# EAGLE design altair (EAGLE 9.4.1)

## Sheet 1 of 2
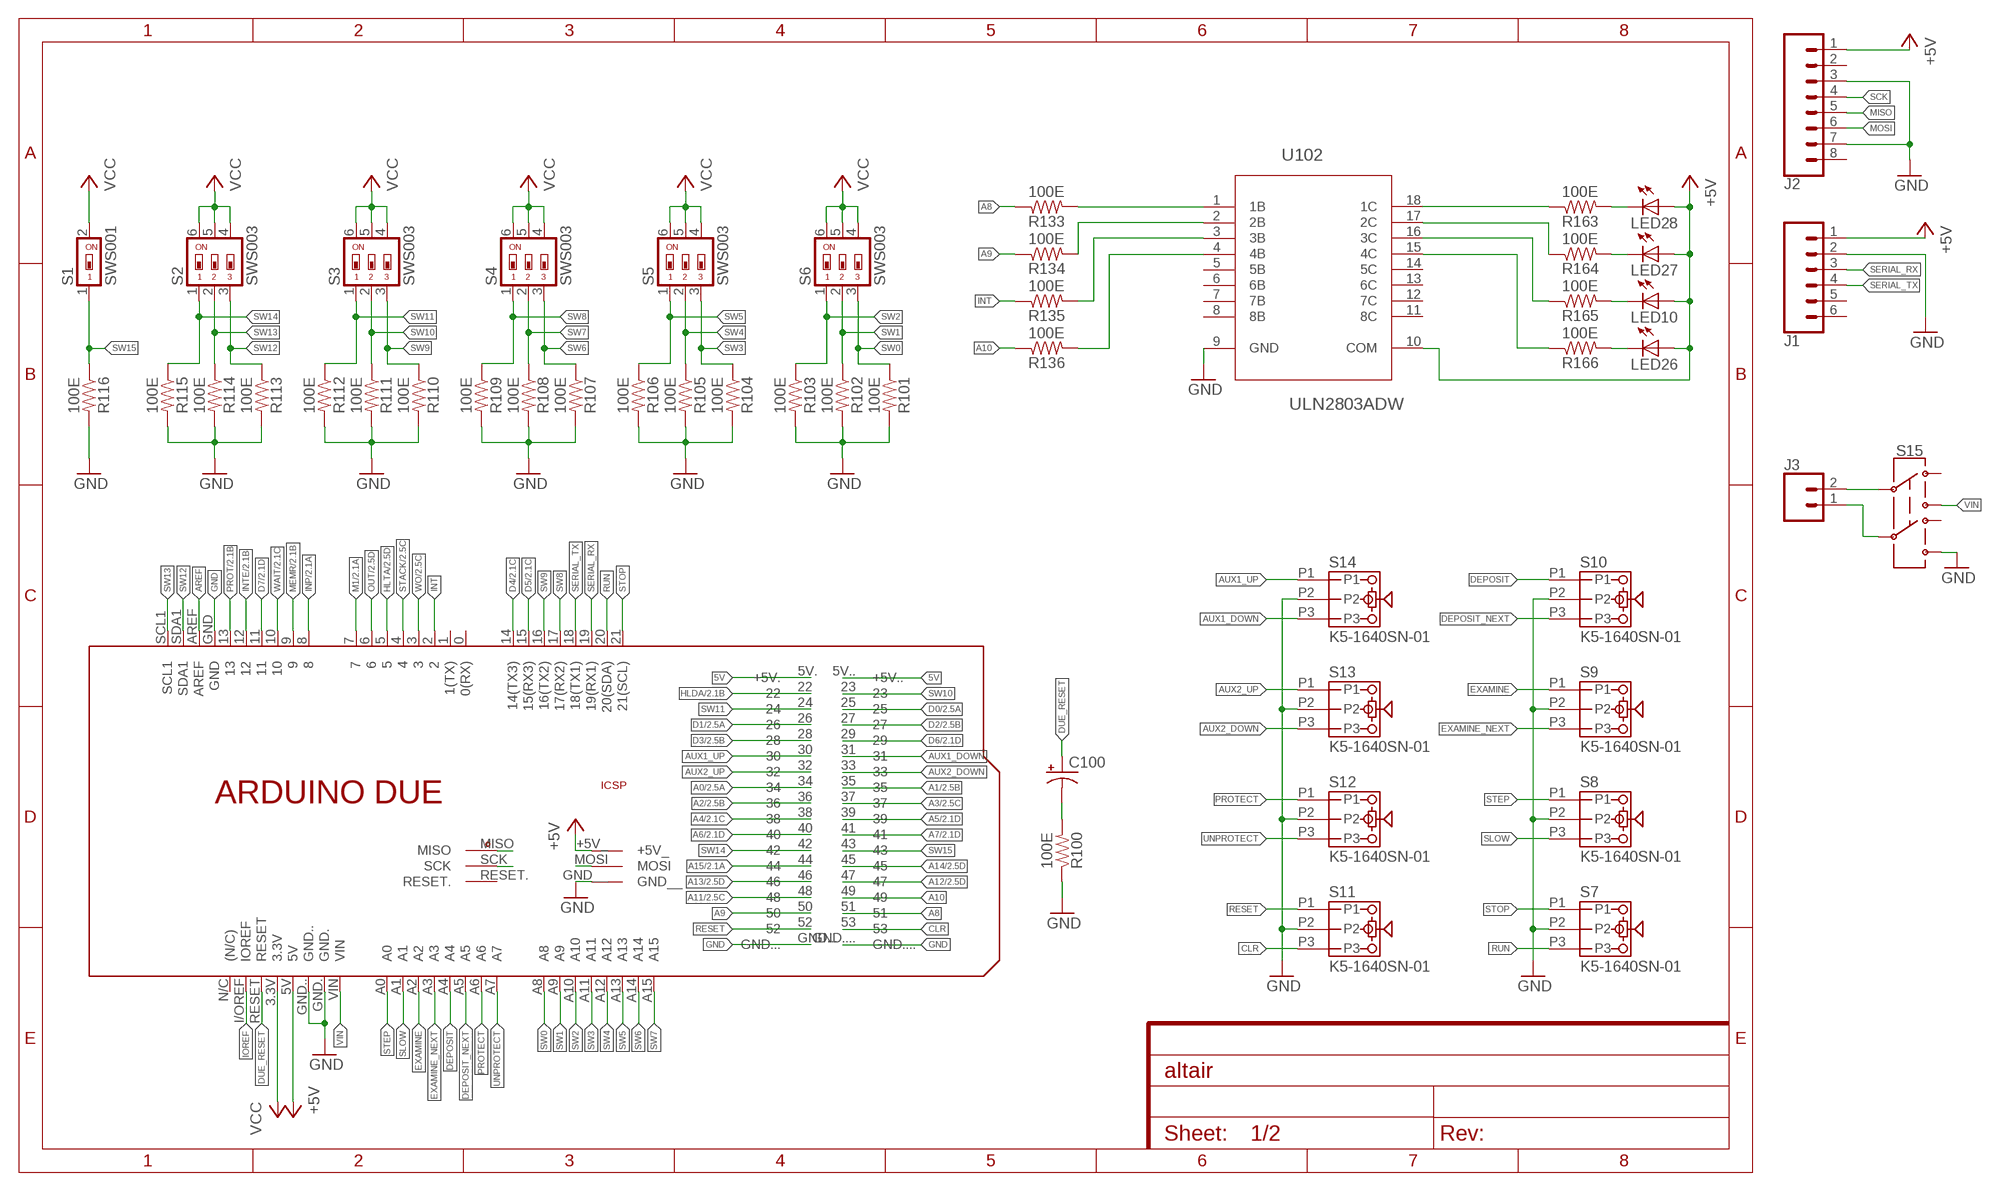
[diagram p0: schematic, sheet 1]

### Parts
C100  CPOL-USD  [PANASONIC_D]
J1  CONN_06LOCK  [1X06_LOCK]
J2  CONN_08LOCK  [1X08_LOCK]
J3  CONN_02POLAR_LOCK  [MOLEX-1X2_LOCK]
LED10  LEDCHIP-LED0805  [CHIP-LED0805]
LED26  LEDCHIP-LED0805  [CHIP-LED0805]
LED27  LEDCHIP-LED0805  [CHIP-LED0805]
LED28  LEDCHIP-LED0805  [CHIP-LED0805]
PCB1  ARDUINO_DUEARDUINO_DUE  [ARDUINO_MEGA2560]
R100  100E  RESISTOR0805  [0805]
R101  100E  RESISTOR0805  [0805]
R102  100E  RESISTOR0805  [0805]
R103  100E  RESISTOR0805  [0805]
R104  100E  RESISTOR0805  [0805]
R105  100E  RESISTOR0805  [0805]
R106  100E  RESISTOR0805  [0805]
R107  100E  RESISTOR0805  [0805]
R108  100E  RESISTOR0805  [0805]
R109  100E  RESISTOR0805  [0805]
R110  100E  RESISTOR0805  [0805]
R111  100E  RESISTOR0805  [0805]
R112  100E  RESISTOR0805  [0805]
R113  100E  RESISTOR0805  [0805]
R114  100E  RESISTOR0805  [0805]
R115  100E  RESISTOR0805  [0805]
R116  100E  RESISTOR0805  [0805]
R133  100E  RESISTOR0805  [0805]
R134  100E  RESISTOR0805  [0805]
R135  100E  RESISTOR0805  [0805]
R136  100E  RESISTOR0805  [0805]
R163  100E  RESISTOR0805  [0805]
R164  100E  RESISTOR0805  [0805]
R165  100E  RESISTOR0805  [0805]
R166  100E  RESISTOR0805  [0805]
S1  SWS001  [SMS-001]
S2  SWS003  [SMS-003]
S3  SWS003  [SMS-003]
S4  SWS003  [SMS-003]
S5  SWS003  [SMS-003]
S6  SWS003  [SMS-003]
S7  K5-1640SN-01  [K5-1640SN-01]
S8  K5-1640SN-01  [K5-1640SN-01]
S9  K5-1640SN-01  [K5-1640SN-01]
S10  K5-1640SN-01  [K5-1640SN-01]
S11  K5-1640SN-01  [K5-1640SN-01]
S12  K5-1640SN-01  [K5-1640SN-01]
S13  K5-1640SN-01  [K5-1640SN-01]
S14  K5-1640SN-01  [K5-1640SN-01]
S15  SWITCH-DPDT-SMD-AYZ0202  [SWITCH_DPDT_SMD_AYZ0202]
U102  ULN2803ADW  [SOIC127P1030X265-18N]

### Nets
5V: PCB1.5V.(+5V.) PCB1.5V..(+5V..)
+5V: J1.1 J2.1 LED10.A LED26.A LED27.A LED28.A PCB1.5V PCB1.+5V_ U102.10(COM) ; also sheet 2
A0: PCB1.34 ; also sheet 2
A1: PCB1.35 ; also sheet 2
A2: PCB1.36 ; also sheet 2
A3: PCB1.37 ; also sheet 2
A4: PCB1.38 ; also sheet 2
A5: PCB1.39 ; also sheet 2
A6: PCB1.40 ; also sheet 2
A7: PCB1.41 ; also sheet 2
A8: PCB1.51 R133.1
A9: PCB1.50 R134.1
A10: PCB1.49 R136.1
A11: PCB1.48 ; also sheet 2
A12: PCB1.47 ; also sheet 2
A13: PCB1.46 ; also sheet 2
A14: PCB1.45 ; also sheet 2
A15: PCB1.44 ; also sheet 2
AREF: PCB1.AREF
AUX1_DOWN: PCB1.31 S14.P3
AUX1_UP: PCB1.30 S14.P1
AUX2_DOWN: PCB1.33 S13.P3
AUX2_UP: PCB1.32 S13.P1
CLR: PCB1.53 S11.P3
D0: PCB1.25 ; also sheet 2
D1: PCB1.26 ; also sheet 2
D2: PCB1.27 ; also sheet 2
D3: PCB1.28 ; also sheet 2
D4: PCB1.14(14(TX3)) ; also sheet 2
D5: PCB1.15(15(RX3)) ; also sheet 2
D6: PCB1.29 ; also sheet 2
D7: PCB1.11 ; also sheet 2
DEPOSIT: PCB1.A4 S10.P1
DEPOSIT_NEXT: PCB1.A5 S10.P3
DUE_RESET: C100.+ PCB1.RESET
EXAMINE: PCB1.A2 S9.P1
EXAMINE_NEXT: PCB1.A3 S9.P3
GND: J1.2 J2.3 J2.7 PCB1.GND PCB1.GND. PCB1.GND.. PCB1.GND... PCB1.GND.... PCB1.GND__ R100.1 R101.2 R102.2 R103.2 R104.2 R105.2 R106.2 R107.2 R108.2 R109.2 R110.2 R111.2 R112.2 R113.2 R114.2 R115.2 R116.2 S7.P2 S8.P2 S9.P2 S10.P2 S11.P2 S12.P2 S13.P2 S14.P2 S15.6 U102.9(GND) ; also sheet 2
HLDA: PCB1.22 ; also sheet 2
HLTA: PCB1.5 ; also sheet 2
INP: PCB1.8 ; also sheet 2
INT: PCB1.2 R135.1
INTE: PCB1.12 ; also sheet 2
IOREF: PCB1.I/OREF(IOREF)
M1: PCB1.7 ; also sheet 2
MEMR: PCB1.9 ; also sheet 2
MISO: J2.5 PCB1.MISO
MOSI: J2.6 PCB1.MOSI
N$1: LED28.C R163.2
N$2: LED27.C R164.2
N$3: LED10.C R165.2
N$4: LED26.C R166.2
N$9: R163.1 U102.18(1C)
N$10: R164.1 U102.17(2C)
N$11: R165.1 U102.16(3C)
N$12: R166.1 U102.15(4C)
N$13: C100.- R100.2
N$19: R133.2 U102.1(1B)
N$20: R134.2 U102.2(2B)
N$21: R135.2 U102.3(3B)
N$22: R136.2 U102.4(4B)
N$97: J3.2 S15.2
N$98: J3.1 S15.5
OUT: PCB1.6 ; also sheet 2
PROT: PCB1.13 ; also sheet 2
PROTECT: PCB1.A6 S12.P1
RESET: PCB1.52 S11.P1
RUN: PCB1.20(20(SDA)) S7.P3
SCK: J2.4 PCB1.SCK
SERIAL_RX: J1.3 PCB1.19(19(RX1))
SERIAL_TX: J1.4 PCB1.18(18(TX1))
SLOW: PCB1.A1 S8.P3
STACK: PCB1.4 ; also sheet 2
STEP: PCB1.A0 S8.P1
STOP: PCB1.21(21(SCL)) S7.P1
SW0: PCB1.A8 R101.1 S6.3
SW1: PCB1.A9 R102.1 S6.2
SW2: PCB1.A10 R103.1 S6.1
SW3: PCB1.A11 R104.1 S5.3
SW4: PCB1.A12 R105.1 S5.2
SW5: PCB1.A13 R106.1 S5.1
SW6: PCB1.A14 R107.1 S4.3
SW7: PCB1.A15 R108.1 S4.2
SW8: PCB1.17(17(RX2)) R109.1 S4.1
SW9: PCB1.16(16(TX2)) R110.1 S3.3
SW10: PCB1.23 R111.1 S3.2
SW11: PCB1.24 R112.1 S3.1
SW12: PCB1.SDA1 R113.1 S2.3
SW13: PCB1.SCL1 R114.1 S2.2
SW14: PCB1.42 R115.1 S2.1
SW15: PCB1.43 R116.1 S1.1
UNPROTECT: PCB1.A7 S12.P3
VCC: PCB1.3.3V S1.2 S2.4 S2.5 S2.6 S3.4 S3.5 S3.6 S4.4 S4.5 S4.6 S5.4 S5.5 S5.6 S6.4 S6.5 S6.6
VIN: PCB1.VIN S15.3
WAIT: PCB1.10 ; also sheet 2
WO: PCB1.3 ; also sheet 2
Unconnected: J1.5 J1.6 J2.2 J2.8 PCB1.0(0(RX)) PCB1.1(1(TX)) PCB1.N/C((N/C)) PCB1.RESET. S15.1 S15.4 U102.5(5B) U102.6(6B) U102.7(7B) U102.8(8B) U102.11(8C) U102.12(7C) U102.13(6C) U102.14(5C)

## Sheet 2 of 2
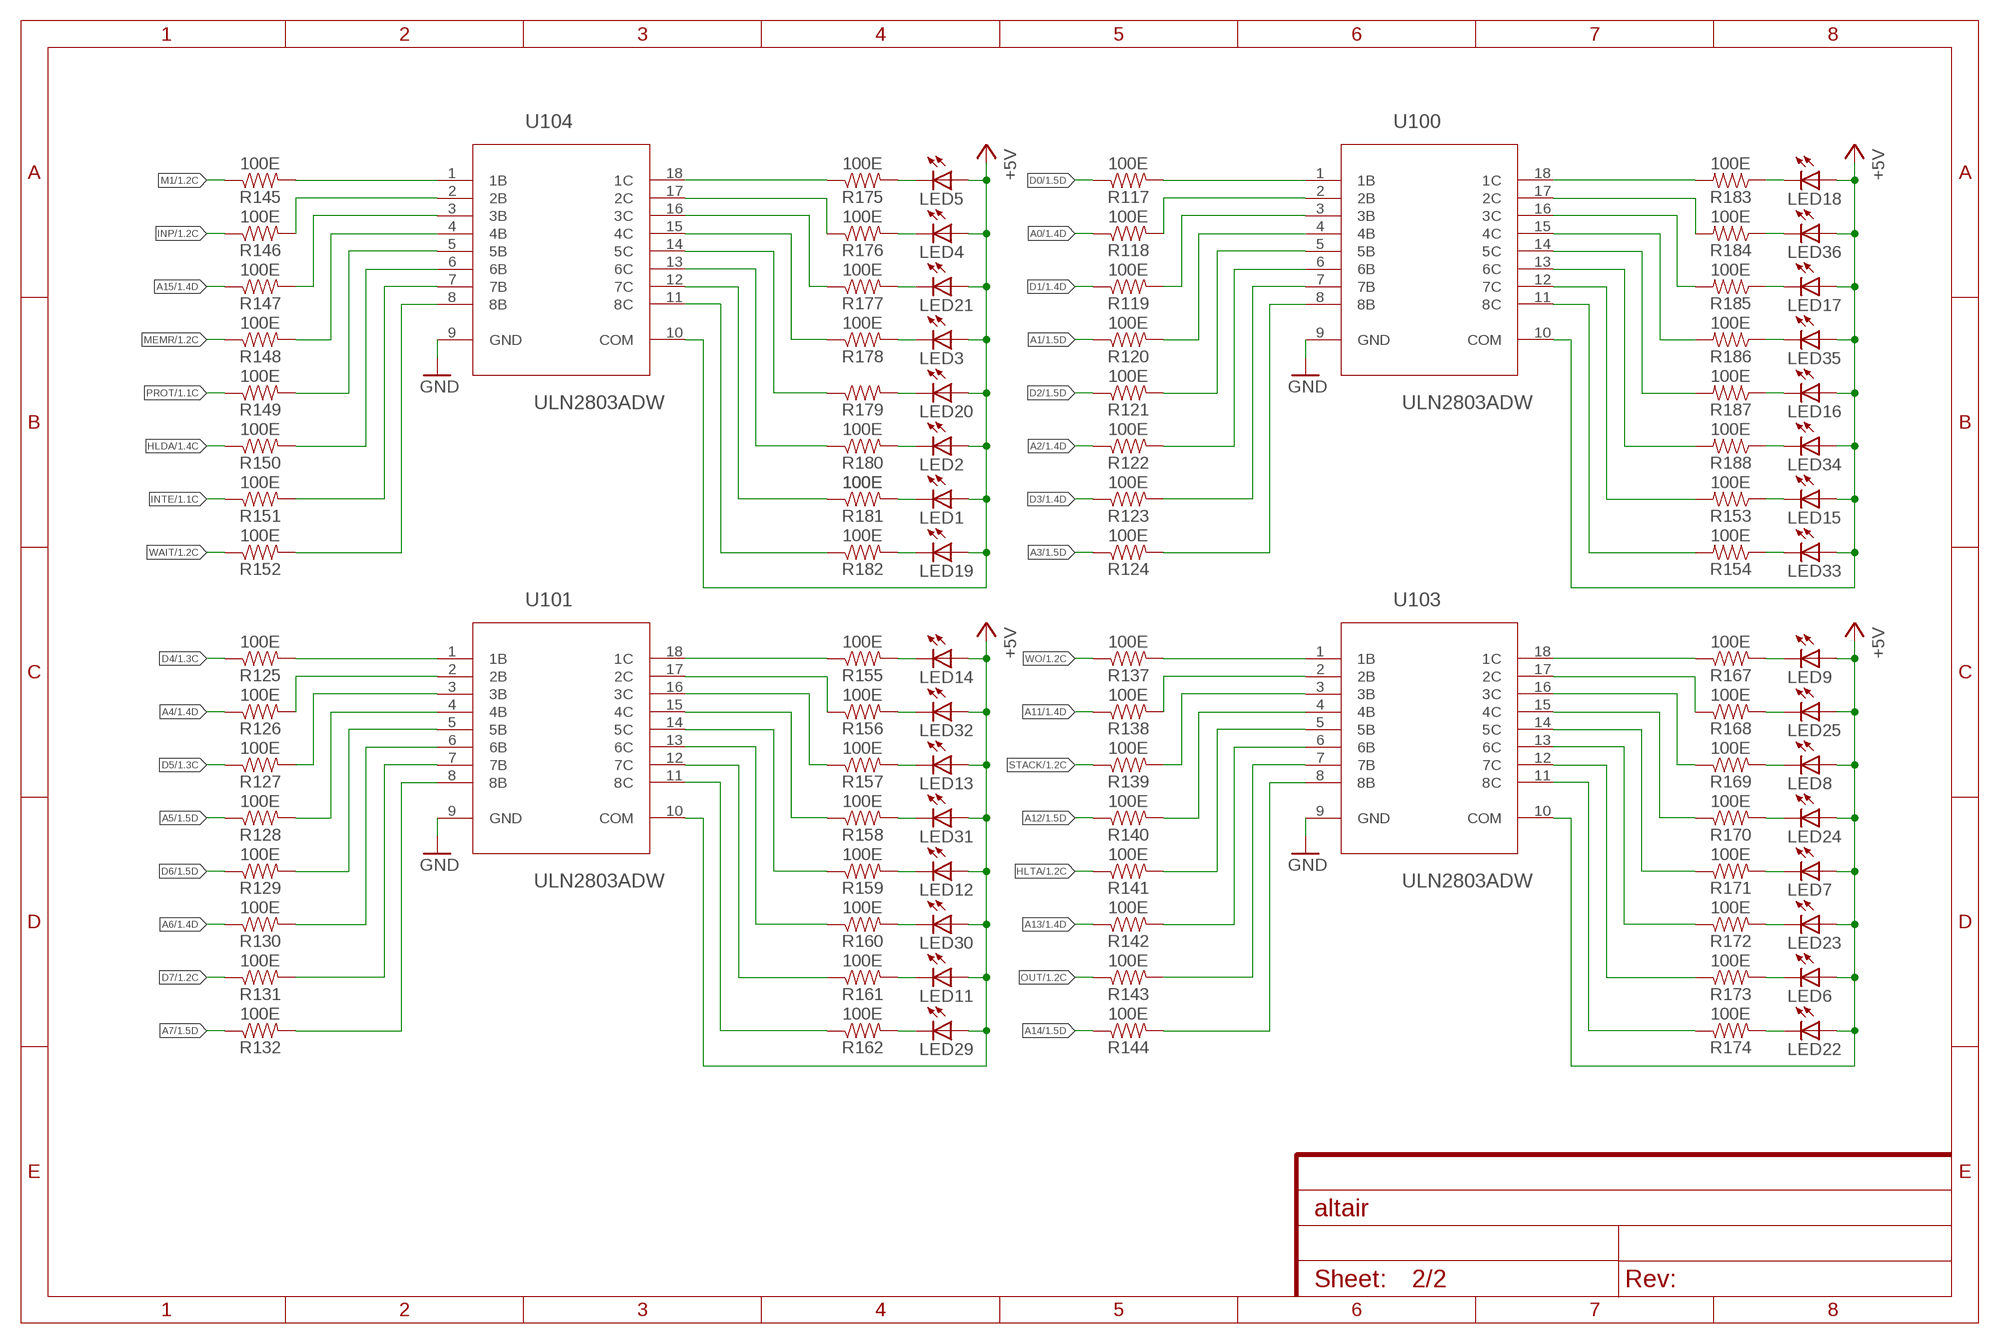
[diagram p1: schematic, sheet 2]

### Parts
LED1  LEDCHIP-LED0805  [CHIP-LED0805]
LED2  LEDCHIP-LED0805  [CHIP-LED0805]
LED3  LEDCHIP-LED0805  [CHIP-LED0805]
LED4  LEDCHIP-LED0805  [CHIP-LED0805]
LED5  LEDCHIP-LED0805  [CHIP-LED0805]
LED6  LEDCHIP-LED0805  [CHIP-LED0805]
LED7  LEDCHIP-LED0805  [CHIP-LED0805]
LED8  LEDCHIP-LED0805  [CHIP-LED0805]
LED9  LEDCHIP-LED0805  [CHIP-LED0805]
LED11  LEDCHIP-LED0805  [CHIP-LED0805]
LED12  LEDCHIP-LED0805  [CHIP-LED0805]
LED13  LEDCHIP-LED0805  [CHIP-LED0805]
LED14  LEDCHIP-LED0805  [CHIP-LED0805]
LED15  LEDCHIP-LED0805  [CHIP-LED0805]
LED16  LEDCHIP-LED0805  [CHIP-LED0805]
LED17  LEDCHIP-LED0805  [CHIP-LED0805]
LED18  LEDCHIP-LED0805  [CHIP-LED0805]
LED19  LEDCHIP-LED0805  [CHIP-LED0805]
LED20  LEDCHIP-LED0805  [CHIP-LED0805]
LED21  LEDCHIP-LED0805  [CHIP-LED0805]
LED22  LEDCHIP-LED0805  [CHIP-LED0805]
LED23  LEDCHIP-LED0805  [CHIP-LED0805]
LED24  LEDCHIP-LED0805  [CHIP-LED0805]
LED25  LEDCHIP-LED0805  [CHIP-LED0805]
LED29  LEDCHIP-LED0805  [CHIP-LED0805]
LED30  LEDCHIP-LED0805  [CHIP-LED0805]
LED31  LEDCHIP-LED0805  [CHIP-LED0805]
LED32  LEDCHIP-LED0805  [CHIP-LED0805]
LED33  LEDCHIP-LED0805  [CHIP-LED0805]
LED34  LEDCHIP-LED0805  [CHIP-LED0805]
LED35  LEDCHIP-LED0805  [CHIP-LED0805]
LED36  LEDCHIP-LED0805  [CHIP-LED0805]
R117  100E  RESISTOR0805  [0805]
R118  100E  RESISTOR0805  [0805]
R119  100E  RESISTOR0805  [0805]
R120  100E  RESISTOR0805  [0805]
R121  100E  RESISTOR0805  [0805]
R122  100E  RESISTOR0805  [0805]
R123  100E  RESISTOR0805  [0805]
R124  100E  RESISTOR0805  [0805]
R125  100E  RESISTOR0805  [0805]
R126  100E  RESISTOR0805  [0805]
R127  100E  RESISTOR0805  [0805]
R128  100E  RESISTOR0805  [0805]
R129  100E  RESISTOR0805  [0805]
R130  100E  RESISTOR0805  [0805]
R131  100E  RESISTOR0805  [0805]
R132  100E  RESISTOR0805  [0805]
R137  100E  RESISTOR0805  [0805]
R138  100E  RESISTOR0805  [0805]
R139  100E  RESISTOR0805  [0805]
R140  100E  RESISTOR0805  [0805]
R141  100E  RESISTOR0805  [0805]
R142  100E  RESISTOR0805  [0805]
R143  100E  RESISTOR0805  [0805]
R144  100E  RESISTOR0805  [0805]
R145  100E  RESISTOR0805  [0805]
R146  100E  RESISTOR0805  [0805]
R147  100E  RESISTOR0805  [0805]
R148  100E  RESISTOR0805  [0805]
R149  100E  RESISTOR0805  [0805]
R150  100E  RESISTOR0805  [0805]
R151  100E  RESISTOR0805  [0805]
R152  100E  RESISTOR0805  [0805]
R153  100E  RESISTOR0805  [0805]
R154  100E  RESISTOR0805  [0805]
R155  100E  RESISTOR0805  [0805]
R156  100E  RESISTOR0805  [0805]
R157  100E  RESISTOR0805  [0805]
R158  100E  RESISTOR0805  [0805]
R159  100E  RESISTOR0805  [0805]
R160  100E  RESISTOR0805  [0805]
R161  100E  RESISTOR0805  [0805]
R162  100E  RESISTOR0805  [0805]
R167  100E  RESISTOR0805  [0805]
R168  100E  RESISTOR0805  [0805]
R169  100E  RESISTOR0805  [0805]
R170  100E  RESISTOR0805  [0805]
R171  100E  RESISTOR0805  [0805]
R172  100E  RESISTOR0805  [0805]
R173  100E  RESISTOR0805  [0805]
R174  100E  RESISTOR0805  [0805]
R175  100E  RESISTOR0805  [0805]
R176  100E  RESISTOR0805  [0805]
R177  100E  RESISTOR0805  [0805]
R178  100E  RESISTOR0805  [0805]
R179  100E  RESISTOR0805  [0805]
R180  100E  RESISTOR0805  [0805]
R181  100E  RESISTOR0805  [0805]
R182  100E  RESISTOR0805  [0805]
R183  100E  RESISTOR0805  [0805]
R184  100E  RESISTOR0805  [0805]
R185  100E  RESISTOR0805  [0805]
R186  100E  RESISTOR0805  [0805]
R187  100E  RESISTOR0805  [0805]
R188  100E  RESISTOR0805  [0805]
U100  ULN2803ADW  [SOIC127P1030X265-18N]
U101  ULN2803ADW  [SOIC127P1030X265-18N]
U103  ULN2803ADW  [SOIC127P1030X265-18N]
U104  ULN2803ADW  [SOIC127P1030X265-18N]

### Nets
+5V: LED1.A LED2.A LED3.A LED4.A LED5.A LED6.A LED7.A LED8.A LED9.A LED11.A LED12.A LED13.A LED14.A LED15.A LED16.A LED17.A LED18.A LED19.A LED20.A LED21.A LED22.A LED23.A LED24.A LED25.A LED29.A LED30.A LED31.A LED32.A LED33.A LED34.A LED35.A LED36.A U100.10(COM) U101.10(COM) U103.10(COM) U104.10(COM) ; also sheet 1
A0: R118.1 ; also sheet 1
A1: R120.1 ; also sheet 1
A2: R122.1 ; also sheet 1
A3: R124.1 ; also sheet 1
A4: R126.1 ; also sheet 1
A5: R128.1 ; also sheet 1
A6: R130.1 ; also sheet 1
A7: R132.1 ; also sheet 1
A11: R138.1 ; also sheet 1
A12: R140.1 ; also sheet 1
A13: R142.1 ; also sheet 1
A14: R144.1 ; also sheet 1
A15: R147.1 ; also sheet 1
D0: R117.1 ; also sheet 1
D1: R119.1 ; also sheet 1
D2: R121.1 ; also sheet 1
D3: R123.1 ; also sheet 1
D4: R125.1 ; also sheet 1
D5: R127.1 ; also sheet 1
D6: R129.1 ; also sheet 1
D7: R131.1 ; also sheet 1
GND: U100.9(GND) U101.9(GND) U103.9(GND) U104.9(GND) ; also sheet 1
HLDA: R150.1 ; also sheet 1
HLTA: R141.1 ; also sheet 1
INP: R146.1 ; also sheet 1
INTE: R151.1 ; also sheet 1
M1: R145.1 ; also sheet 1
MEMR: R148.1 ; also sheet 1
N$5: R183.2 U100.18(1C)
N$6: R184.2 U100.17(2C)
N$7: R185.2 U100.16(3C)
N$8: R186.2 U100.15(4C)
N$14: R187.2 U100.14(5C)
N$15: R188.2 U100.13(6C)
N$16: R153.2 U100.12(7C)
N$17: LED5.C R175.2
N$18: LED4.C R176.2
N$23: R154.2 U100.11(8C)
N$24: LED18.C R183.1
N$25: LED36.C R184.1
N$26: LED17.C R185.1
N$27: LED21.C R177.2
N$28: LED3.C R178.2
N$29: LED20.C R179.2
N$30: LED2.C R180.2
N$31: LED1.C R181.2
N$32: LED19.C R182.2
N$33: R181.1 U104.12(7C)
N$34: R176.1 U104.17(2C)
N$35: R177.1 U104.16(3C)
N$36: R178.1 U104.15(4C)
N$37: R179.1 U104.14(5C)
N$38: R180.1 U104.13(6C)
N$39: R182.1 U104.11(8C)
N$40: R175.1 U104.18(1C)
N$41: R145.2 U104.1(1B)
N$42: R146.2 U104.2(2B)
N$43: R147.2 U104.3(3B)
N$44: R148.2 U104.4(4B)
N$45: R149.2 U104.5(5B)
N$46: R150.2 U104.6(6B)
N$47: R151.2 U104.7(7B)
N$48: R152.2 U104.8(8B)
N$49: LED35.C R186.1
N$50: LED16.C R187.1
N$51: LED34.C R188.1
N$52: LED15.C R153.1
N$53: LED33.C R154.1
N$54: LED9.C R167.2
N$55: R173.1 U103.12(7C)
N$56: R174.1 U103.11(8C)
N$57: LED25.C R168.2
N$58: LED8.C R169.2
N$59: LED24.C R170.2
N$60: LED7.C R171.2
N$61: LED23.C R172.2
N$62: LED6.C R173.2
N$63: LED22.C R174.2
N$64: R167.1 U103.18(1C)
N$65: R117.2 U100.1(1B)
N$66: R118.2 U100.2(2B)
N$67: R119.2 U100.3(3B)
N$68: R120.2 U100.4(4B)
N$69: R121.2 U100.5(5B)
N$70: R122.2 U100.6(6B)
N$71: R123.2 U100.7(7B)
N$72: R124.2 U100.8(8B)
N$73: R161.1 U101.12(7C)
N$74: R162.1 U101.11(8C)
N$75: LED14.C R155.2
N$76: LED32.C R156.2
N$77: LED13.C R157.2
N$78: LED31.C R158.2
N$79: LED12.C R159.2
N$80: LED30.C R160.2
N$81: LED11.C R161.2
N$82: R156.1 U101.17(2C)
N$83: R157.1 U101.16(3C)
N$84: R158.1 U101.15(4C)
N$85: R159.1 U101.14(5C)
N$86: R160.1 U101.13(6C)
N$87: LED29.C R162.2
N$88: R155.1 U101.18(1C)
N$89: R125.2 U101.1(1B)
N$90: R126.2 U101.2(2B)
N$91: R127.2 U101.3(3B)
N$92: R128.2 U101.4(4B)
N$93: R129.2 U101.5(5B)
N$94: R130.2 U101.6(6B)
N$95: R131.2 U101.7(7B)
N$96: R132.2 U101.8(8B)
N$106: R168.1 U103.17(2C)
N$107: R169.1 U103.16(3C)
N$108: R170.1 U103.15(4C)
N$109: R171.1 U103.14(5C)
N$110: R172.1 U103.13(6C)
N$113: R137.2 U103.1(1B)
N$114: R138.2 U103.2(2B)
N$115: R139.2 U103.3(3B)
N$116: R140.2 U103.4(4B)
N$117: R141.2 U103.5(5B)
N$118: R142.2 U103.6(6B)
N$119: R143.2 U103.7(7B)
N$120: R144.2 U103.8(8B)
OUT: R143.1 ; also sheet 1
PROT: R149.1 ; also sheet 1
STACK: R139.1 ; also sheet 1
WAIT: R152.1 ; also sheet 1
WO: R137.1 ; also sheet 1

## Library data of the parts
C100 = adafruit:CPOL-US: POLARIZED CAPACITOR, American symbol
J1 = SparkFun-Connectors:CONN_06: Multi connection point. Often used as Generic Header-pin footprint for 0.1 inch spaced/style header connections On any of the 0.1 inch spaced packages, you can populate with these: Break Away Headers - Straight <https://www.sparkfun.com/products/116> (PRT-00116) Break Away Male Headers - Right Angle <https://www.sparkfun.com/products/553> (PRT-00553) Female Headers <https://www.sparkfun.com/products/115> (PRT-00115) Break Away Headers - Machine Pin <https://www.sparkfun.com/products/117> (PRT-00117) Break Away Female Headers - Swiss Machine Pin <https://www.sparkfun.com/products/743> (PRT-00743) Arduino Stackable Header - 6 Pin <https://www.sparkfun.com/products/9280> (PRT-09280) For SCREWTERMINALS and SPRING TERMINALS visit here: Screw Terimnals on SparkFun.com <https://www.sparkfun.com/search/results?term=Screw+Terminals> (5mm/3.5mm/2.54mm spacing) This device is also useful as a general connection point to wire up your design to another part of your project. Our various solder wires solder well into these plated through hole pads. Hook-Up Wire - Assortment (Stranded, 22 AWG) <https://www.sparkfun.com/products/11375> (PRT-11375) Hook-Up Wire - Assortment (Solid Core, 22 AWG) <https://www.sparkfun.com/products/11367> (PRT-11367) View the entire wire category on our website here <https://www.sparkfun.com/categories/141>
J2 = SparkFun-Connectors:CONN_08: Multi connection point. Often used as Generic Header-pin footprint for 0.1 inch spaced/style header connections On any of the 0.1 inch spaced packages, you can populate with these: Break Away Headers - Straight <https://www.sparkfun.com/products/116> (PRT-00116) Break Away Male Headers - Right Angle <https://www.sparkfun.com/products/553> (PRT-00553) Female Headers <https://www.sparkfun.com/products/115> (PRT-00115) Break Away Headers - Machine Pin <https://www.sparkfun.com/products/117> (PRT-00117) Break Away Female Headers - Swiss Machine Pin <https://www.sparkfun.com/products/743> (PRT-00743) Arduino Stackable Header - 8 Pin <https://www.sparkfun.com/products/9279> (PRT-09279) For SCREWTERMINALS and SPRING TERMINALS visit here: Screw Terimnals on SparkFun.com <https://www.sparkfun.com/search/results?term=Screw+Terminals> (5mm/3.5mm/2.54mm spacing) This device is also useful as a general connection point to wire up your design to another part of your project. Our various solder wires solder well into these plated through hole pads. Hook-Up Wire - Assortment (Stranded, 22 AWG) <https://www.sparkfun.com/products/11375> (PRT-11375) Hook-Up Wire - Assortment (Solid Core, 22 AWG) <https://www.sparkfun.com/products/11367> (PRT-11367) View the entire wire category on our website here <https://www.sparkfun.com/categories/141> Special notes: Molex polarized connector foot print use with SKU : PRT-08231 with associated crimp pins and housings. 1MM SMD Version SKU: PRT-10208 NOTES ON THE VARIANTS LOCK and LOCK_LONGPADS... This footprint was designed to help hold the alignment of a through-hole component (i.e. 6-pin header) while soldering it into place. You may notice that each hole has been shifted either up or down by 0.005 of an inch from it's more standard position (which is a perfectly straight line). This slight alteration caused the pins (the squares in the middle) to touch the edges of the holes. Because they are alternating, it causes a "brace" to hold the component in place. 0.005 has proven to be the perfect amount of "off-center" position when using our standard breakaway headers. Although looks a little odd when you look at the bare footprint, once you have a header in there, the alteration is very hard to notice. Also,if you push a header all the way into place, it is covered up entirely on the bottom side.
J3 = SparkFun-Connectors:CONN_02: Multi connection point. Often used as Generic Header-pin footprint for 0.1 inch spaced/style header connections On any of the 0.1 inch spaced packages, you can populate with these: Break Away Headers - Straight <https://www.sparkfun.com/products/116> (PRT-00116) Break Away Male Headers - Right Angle <https://www.sparkfun.com/products/553> (PRT-00553) Female Headers <https://www.sparkfun.com/products/115> (PRT-00115) Break Away Headers - Machine Pin <https://www.sparkfun.com/products/117> (PRT-00117) Break Away Female Headers - Swiss Machine Pin <https://www.sparkfun.com/products/743> (PRT-00743) For SCREWTERMINALS and SPRING TERMINALS visit here: Screw Terimnals on SparkFun.com <https://www.sparkfun.com/search/results?term=Screw+Terminals> (5mm/3.5mm/2.54mm spacing) This device is also useful as a general connection point to wire up your design to another part of your project. Our various solder wires solder well into these plated through hole pads. Hook-Up Wire - Assortment (Stranded, 22 AWG) <https://www.sparkfun.com/products/11375> (PRT-11375) Hook-Up Wire - Assortment (Solid Core, 22 AWG) <https://www.sparkfun.com/products/11367> (PRT-11367) View the entire wire category on our website here <https://www.sparkfun.com/categories/141> Special notes: Molex polarized connector foot print use with: PRT-08233 with associated crimp pins and housings. 2.54_SCREWTERM for use with PRT-10571. 3.5mm Screw Terminal footprints for PRT-08084 5mm Screw Terminal footprints for use with PRT-08432; SF_ID: PRT-09918
LED1-LED36 = adafruit:LED: LED OSRAM: - CHIPLED LG R971, LG N971, LY N971, LG Q971, LY Q971, LO R971, LY R971 LH N974, LH R974 LS Q976, LO Q976, LY Q976 LO Q996 - Hyper CHIPLED LW Q18S LB Q993, LB Q99A, LB R99A - SideLED LS A670, LO A670, LY A670, LG A670, LP A670 LB A673, LV A673, LT A673, LW A673 LH A674 LY A675 LS A676, LA A676, LO A676, LY A676, LW A676 LS A679, LY A679, LG A679 - Hyper Micro SIDELED® LS Y876, LA Y876, LO Y876, LY Y876 LT Y87S - SmartLED LW L88C, LW L88S LB L89C, LB L89S, LG L890 LS L89K, LO L89K, LY L89K LS L896, LA L896, LO L896, LY L896 - TOPLED LS T670, LO T670, LY T670, LG T670, LP T670 LSG T670, LSP T670, LSY T670, LOP T670, LYG T670 LG T671, LOG T671, LSG T671 LB T673, LV T673, LT T673, LW T673 LH T674 LS T676, LA T676, LO T676, LY T676, LB T676, LH T676, LSB T676, LW T676 LB T67C, LV T67C, LT T67C, LS T67K, LO T67K, LY T67K, LW E67C LS E67B, LA E67B, LO E67B, LY E67B, LB E67C, LV E67C, LT E67C LW T67C LS T679, LY T679, LG T679 LS T770, LO T770, LY T770, LG T770, LP T770 LB T773, LV T773, LT T773, LW T773 LH T774 LS E675, LA E675, LY E675, LS T675 LS T776, LA T776, LO T776, LY T776, LB T776 LHGB T686 LT T68C, LB T68C - Hyper Mini TOPLED® LB M676 - Mini TOPLED Santana® LG M470 LS M47K, LO M47K, LY M47K Source: http://www.osram.convergy.de/
PCB1 = Mega:ARDUINO_DUE: Device for representing an Arduino Mega 2560 board with a footprint in an EAGLE design. Created by Dave Young for Element14. More EAGLE documentation at: http://www.element14.com/community/community/knode/cadsoft_eagle
R100-R188 = SparkFun-Resistors:RESISTOR: Generic Resistor Package
S1 = smd-special:SWS001: SMD Dip Switch 1 pol.
S2-S6 = smd-special:SWS003: SMD Dip Switch 3 pol.
S7-S14 = K5-1640SN-01:K5-1640SN-01: K5-1640SN-01
S15 = SparkFun-Switches:SWITCH-DPDT: Double-Pole, Double-Throw (DPDT) Switch Double-pole, double-throw switches. Variant Overview PTH-GPI-152-3013 Used on SparkFun Geiger Counter <https://www.sparkfun.com/products/11345> SMD-AY0202 Surface Mount DPDT Switch <https://www.sparkfun.com/products/597> (COM-00597) Used on e.g. LilyPad Arduino USB - ATmega32U4 Board <https://www.sparkfun.com/products/12049>; PROD_ID: SWCH-08179; SF_SKU: COM-00597
U100-U104 = Texas Instruments_By_element14_Batch_1:ULN2803ADW: Darlington transistor array; MPN: ULN2803ADW; OC_FARNELL: 1652419; OC_NEWARK: 69K0711; PACKAGE: SOIC-18; SUPPLIER: TEXAS INSTRUMENTS

## Board
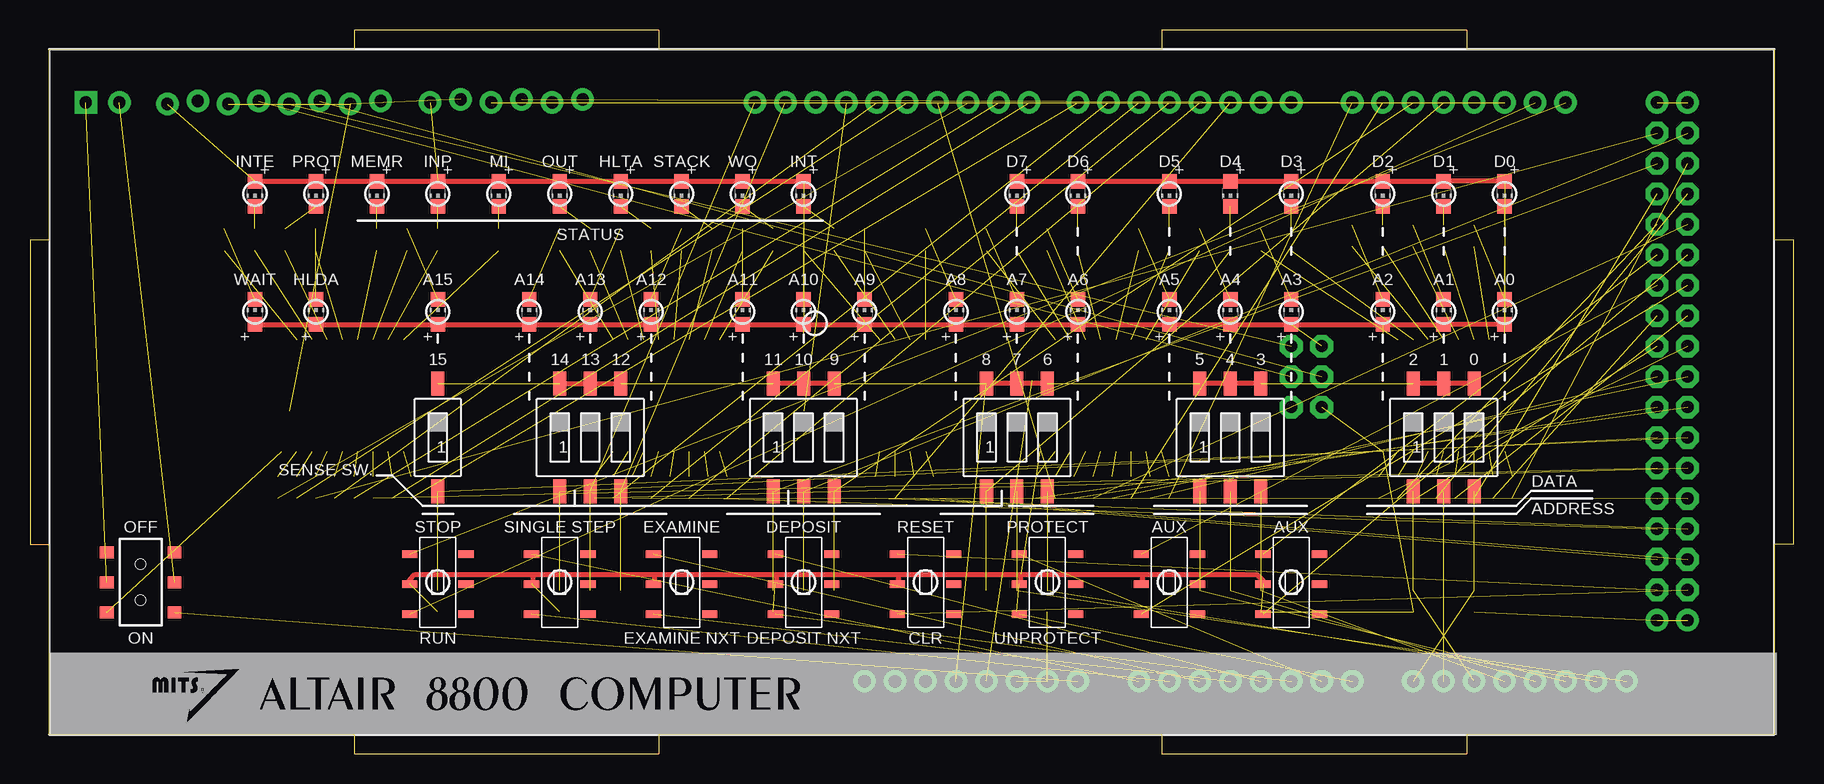
[diagram p2: board, top side]
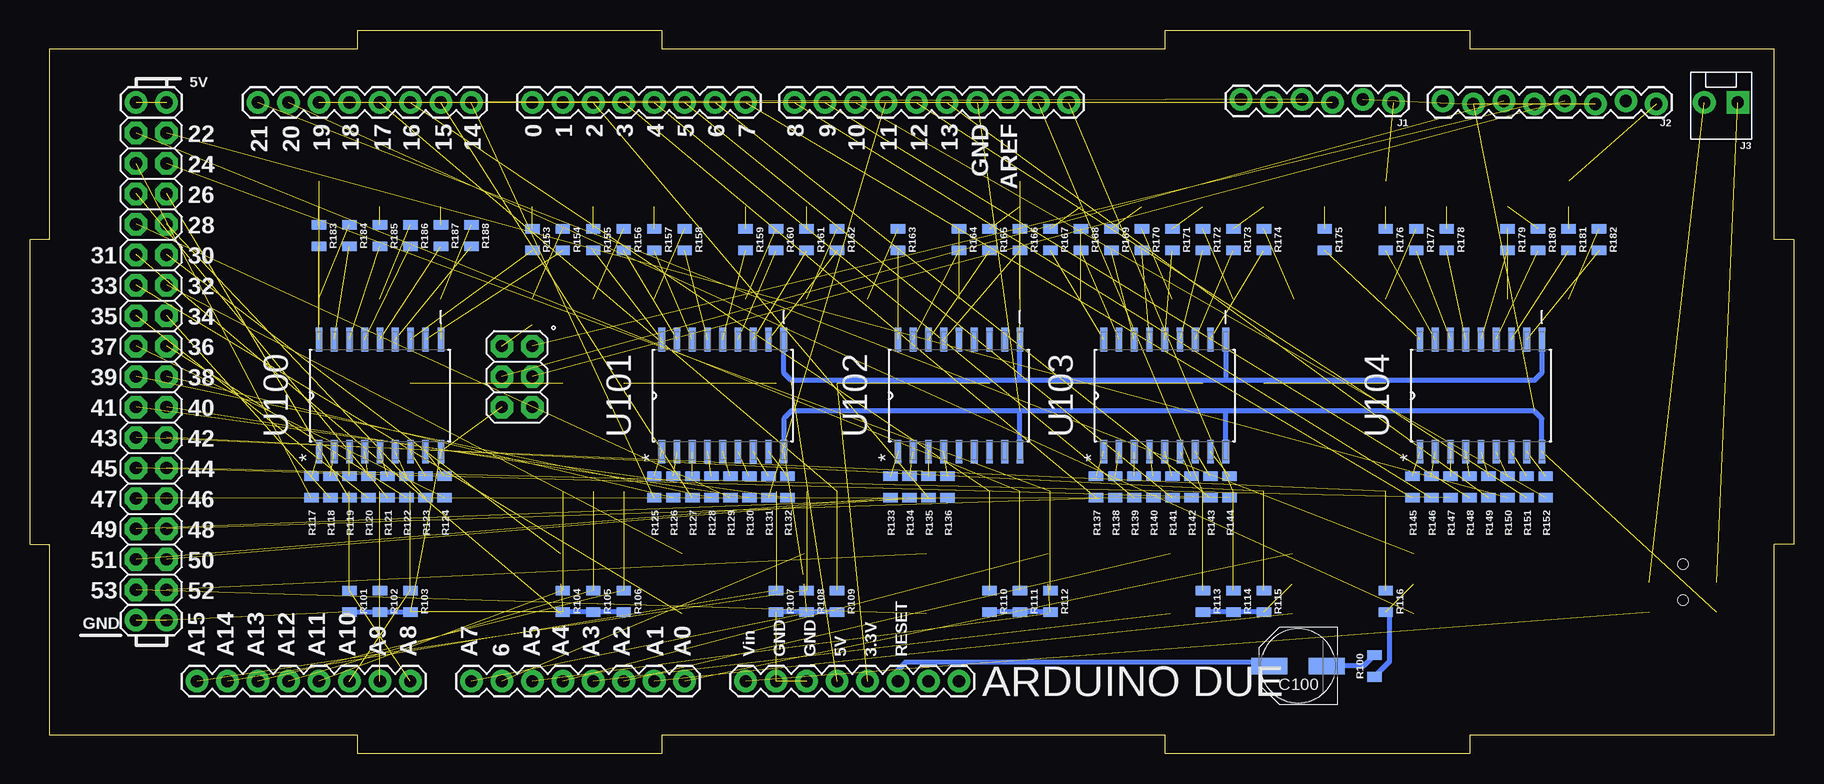
[diagram p3: board, bottom side, seen from below]

Size 146.96 x 60.35 mm. Coordinates in mm from the lower left corner, seen from the top.
Outline: 1.6,1.6 1.6,17.48 0,17.48 0,42.88 1.6,42.88 1.6,58.75 27,58.75 27,60.35 52.4,60.35 52.4,58.75 94.31,58.75 94.31,60.35 119.71,60.35 119.71,58.75 145.36,58.75 145.36,42.88 146.96,42.88 146.96,17.48 145.36,17.48 145.36,1.6 119.71,1.6 119.71,0 94.31,0 94.31,1.6 52.4,1.6 52.4,0 27,0 27,1.6 1.6,1.6
Copper layers (1*16): Top 0.035mm / dielectric 1.5mm / Bottom 0.035mm
Design rules "SeeedStudio_2layer_DRU_no_angle_20140221 *": minimum track width 16mil, minimum drill 12mil, track to track 6mil, track to pad 6mil, pad to pad 6mil, via to via 6mil, smd to smd 0mil, copper to edge 10mil, drill to drill 10mil, minimum pad ring 10mil, minimum via ring 6mil, stop-mask expansion 2mil, vias tented up to drill 100mil, thermal gap 10mil

### Footprints (pad centres in the part's own frame; a part is rotated, then mirrored left to right if it is on the bottom)
PANASONIC_D = smd 3 x 1.4: + 2.4,0; - -2.4,0
1X06_LOCK = drill 1.016 pad 1.88: 1 0,0; 2 2.54,-0.254; 3 5.08,0; 4 7.62,-0.254; 5 10.16,0; 6 12.7,-0.254
1X08_LOCK = drill 1.016 pad 1.88: 1 0,0.127; 2 2.54,-0.127; 3 5.08,0.127; 4 7.62,-0.127; 5 10.16,0.127; 6 12.7,-0.127; 7 15.24,0.127; 8 17.78,-0.127
MOLEX-1X2_LOCK = drill 1.016 pad 1.88 square: 1 -0.127,0 | drill 1.016 pad 1.88: 2 2.667,0
CHIP-LED0805 = smd 1.2 x 1.2: A 0,-1.05; C 0,1.05
ARDUINO_MEGA2560 = drill 1.016 pad 1.88: 0 63.5,50.8; 1 60.96,50.8; 2 58.42,50.8; 3 55.88,50.8; 3.3V 35.56,2.54; 4 53.34,50.8; 5 50.8,50.8; 5V 38.1,2.54; 5V. 93.98,50.8; 5V.. 96.52,50.8; 6 48.26,50.8; 7 45.72,50.8; 8 41.656,50.8; 9 39.116,50.8; 10 36.576,50.8; 11 34.036,50.8; 12 31.496,50.8; 13 28.956,50.8; 14 68.58,50.8; 15 71.12,50.8; 16 73.66,50.8; 17 76.2,50.8; 18 78.74,50.8; 19 81.28,50.8; 20 83.82,50.8; 21 86.36,50.8; A0 50.8,2.54; A1 53.34,2.54; A2 55.88,2.54; A3 58.42,2.54; A4 60.96,2.54; A5 63.5,2.54; A6 66.04,2.54; A7 68.58,2.54; A8 73.66,2.54; A9 76.2,2.54; A10 78.74,2.54; A11 81.28,2.54; A12 83.82,2.54; A13 86.36,2.54; A14 88.9,2.54; A15 91.44,2.54; AREF 23.876,50.8; GND 26.416,50.8; GND. 43.18,2.54; GND.. 40.64,2.54; GND... 93.98,7.62; GND.... 96.52,7.62; I/OREF 30.48,2.54; N/C 27.94,2.54; RESET 33.02,2.54; SCL1 18.796,50.8; SDA1 21.336,50.8; VIN 45.72,2.54 | drill 1.016 pad 1.88 octagon: 22 93.98,48.26; 23 96.52,48.26; 24 93.98,45.72; 25 96.52,45.72; 26 93.98,43.18; 27 96.52,43.18; 28 93.98,40.64; 29 96.52,40.64; 30 93.98,38.1; 31 96.52,38.1; 32 93.98,35.56; 33 96.52,35.56; 34 93.98,33.02; 35 96.52,33.02; 36 93.98,30.48; 37 96.52,30.48; 38 93.98,27.94; 39 96.52,27.94; 40 93.98,25.4; 41 96.52,25.4; 42 93.98,22.86; 43 96.52,22.86; 44 93.98,20.32; 45 96.52,20.32; 46 93.98,17.78; 47 96.52,17.78; 48 93.98,15.24; 49 96.52,15.24; 50 93.98,12.7; 51 96.52,12.7; 52 93.98,10.16; 53 96.52,10.16; +5V_ 66.04,30.48; GND__ 66.04,25.4; MISO 63.5,30.48; MOSI 66.04,27.94; RESET. 63.5,25.4; SCK 63.5,27.94
0805 = smd 0.8 x 1.2: 1 -0.9,0; 2 0.9,0
SMS-001 = smd 1.092 x 2.007: 1 0,-4.496; 2 0,4.496
SMS-003 = smd 1.092 x 2.007: 1 -2.54,-4.496; 2 0,-4.496; 3 2.54,-4.496; 4 2.54,4.496; 5 0,4.496; 6 -2.54,4.496
K5-1640SN-01 = smd 1.27 x 0.635: P1 -2.35,2.35; P2 -2.35,-0.15; P3 -2.35,-2.65; P4 2.35,-2.65; P5 2.35,-0.15; P6 2.35,2.35
SWITCH_DPDT_SMD_AYZ0202 = smd 1 x 1.15: 1 -2.5,2.825; 2 0,2.825; 3 2.5,2.825; 4 -2.5,-2.825; 5 0,-2.825; 6 2.5,-2.825 | hole 0.85: 1.5,0; -1.5,0
SOIC127P1030X265-18N = smd 1.981 x 0.559: 1 -4.674,5.08; 2 -4.674,3.81; 3 -4.674,2.54; 4 -4.674,1.27; 5 -4.674,0; 6 -4.674,-1.27; 7 -4.674,-2.54; 8 -4.674,-3.81; 9 -4.674,-5.08; 10 4.674,-5.08; 11 4.674,-3.81; 12 4.674,-2.54; 13 4.674,-1.27; 14 4.674,0; 15 4.674,1.27; 16 4.674,2.54; 17 4.674,3.81; 18 4.674,5.08

### Placement (x,y rotation side)
C100  41.29,7.32 180 bottom
J1  33.35,54.31 180 bottom
J2  11.44,54.31 180 bottom
J3  4.78,54.31 180 bottom
LED1  18.75,46.69 180 top
LED2  23.83,46.69 180 top
LED3  28.91,46.69 180 top
LED4  33.99,46.69 180 top
LED5  39.07,46.69 180 top
LED6  44.15,46.69 180 top
LED7  49.23,46.69 180 top
LED8  54.31,46.69 180 top
LED9  59.39,46.69 180 top
LED10  64.47,46.69 180 top
LED11  82.25,46.69 180 top
LED12  87.33,46.69 180 top
LED13  94.95,46.69 180 top
LED14  100.03,46.69 180 top
LED15  105.11,46.69 180 top
LED16  112.73,46.69 180 top
LED17  117.81,46.69 180 top
LED18  122.89,46.69 180 top
LED19  18.75,36.84 0 top
LED20  23.83,36.84 0 top
LED21  33.99,36.84 0 top
LED22  41.61,36.84 0 top
LED23  46.69,36.84 0 top
LED24  51.77,36.84 0 top
LED25  59.39,36.84 0 top
LED26  64.47,36.84 0 top
LED27  69.55,36.84 0 top
LED28  77.17,36.84 0 top
LED29  82.25,36.84 0 top
LED30  87.33,36.84 0 top
LED31  94.95,36.84 0 top
LED32  100.03,36.84 0 top
LED33  105.11,36.84 0 top
LED34  112.73,36.84 0 top
LED35  117.81,36.84 0 top
LED36  122.89,36.84 0 top
PCB1  41.61,3.51 0 top
R100  34.94,7.32 90 bottom
R101  120.35,12.71 270 bottom
R102  117.81,12.71 270 bottom
R103  115.27,12.71 270 bottom
R104  102.57,12.71 270 bottom
R105  100.03,12.71 270 bottom
R106  97.49,12.71 270 bottom
R107  84.79,12.71 270 bottom
R108  82.25,12.71 270 bottom
R109  79.71,12.71 270 bottom
R110  67.01,12.71 270 bottom
R111  64.47,12.71 270 bottom
R112  61.93,12.71 270 bottom
R113  49.23,12.71 270 bottom
R114  46.69,12.71 270 bottom
R115  44.15,12.71 270 bottom
R116  33.99,12.71 270 bottom
R117  123.52,22.24 90 bottom
R118  121.93,22.24 90 bottom
R119  120.35,22.24 90 bottom
R120  118.76,22.24 90 bottom
R121  117.17,22.24 90 bottom
R122  115.58,22.24 90 bottom
R123  114,22.24 90 bottom
R124  112.41,22.24 90 bottom
R125  94.95,22.24 90 bottom
R126  93.36,22.24 90 bottom
R127  91.77,22.24 90 bottom
R128  90.18,22.24 90 bottom
R129  88.6,22.24 90 bottom
R130  87.01,22.24 90 bottom
R131  85.42,22.24 90 bottom
R132  83.83,22.24 90 bottom
R133  75.26,22.24 90 bottom
R134  73.67,22.24 90 bottom
R135  72.09,22.24 90 bottom
R136  70.5,22.24 90 bottom
R137  58.12,22.24 90 bottom
R138  56.53,22.24 90 bottom
R139  54.94,22.24 90 bottom
R140  53.35,22.24 90 bottom
R141  51.77,22.24 90 bottom
R142  50.18,22.24 90 bottom
R143  48.59,22.24 90 bottom
R144  47,22.24 90 bottom
R145  31.76,22.24 90 bottom
R146  30.18,22.24 90 bottom
R147  28.59,22.24 90 bottom
R148  27,22.24 90 bottom
R149  25.41,22.24 90 bottom
R150  23.83,22.24 90 bottom
R151  22.24,22.24 90 bottom
R152  20.65,22.24 90 bottom
R153  105.11,42.88 270 bottom
R154  102.57,42.88 270 bottom
R155  100.03,42.88 90 bottom
R156  97.49,42.88 90 bottom
R157  94.95,42.88 90 bottom
R158  92.41,42.88 90 bottom
R159  87.33,42.88 90 bottom
R160  84.79,42.88 90 bottom
R161  82.25,42.88 90 bottom
R162  79.71,42.88 90 bottom
R163  74.63,42.88 90 bottom
R164  69.55,42.88 90 bottom
R165  67.01,42.88 90 bottom
R166  64.47,42.88 90 bottom
R167  61.93,42.88 90 bottom
R168  59.39,42.88 90 bottom
R169  56.85,42.88 90 bottom
R170  54.31,42.88 90 bottom
R171  51.77,42.88 90 bottom
R172  49.23,42.88 90 bottom
R173  46.69,42.88 90 bottom
R174  44.15,42.88 90 bottom
R175  39.07,42.88 90 bottom
R176  33.99,42.88 90 bottom
R177  31.45,42.88 90 bottom
R178  28.91,42.88 90 bottom
R179  23.83,42.88 90 bottom
R180  21.29,42.88 90 bottom
R181  18.75,42.88 90 bottom
R182  16.21,42.88 90 bottom
R183  122.89,43.19 270 bottom
R184  120.35,43.19 270 bottom
R185  117.81,43.19 270 bottom
R186  115.27,43.19 270 bottom
R187  112.73,43.19 270 bottom
R188  110.19,43.19 270 bottom
S1  33.99,26.37 0 top
S2  46.69,26.37 0 top
S3  64.47,26.37 0 top
S4  82.25,26.37 0 top
S5  100.03,26.37 0 top
S6  117.81,26.37 0 top
S7  33.99,14.3 0 top
S8  44.15,14.3 0 top
S9  54.31,14.3 0 top
S10  64.47,14.3 0 top
S11  74.63,14.3 0 top
S12  84.79,14.3 0 top
S13  94.95,14.3 0 top
S14  105.11,14.3 0 top
S15  9.22,14.3 270 top
U100  117.81,29.86 90 bottom
U101  89.23,29.86 90 bottom
U102  69.55,29.86 90 bottom
U103  52.4,29.86 90 bottom
U104  26.05,29.86 90 bottom

### Tracks (layer width: path | path; a pad name or v marks a point on that pad's centre or on a via)
5V  (1 unrouted)
+5V  (8 unrouted)
  Top 0.406: LED1.A LED2.A LED3.A LED4.A LED5.A LED6.A LED7.A LED8.A LED9.A LED10.A | LED11.A LED12.A LED13.A LED14.A LED15.A LED16.A LED17.A LED18.A | LED36.A LED35.A LED34.A LED33.A LED32.A LED31.A LED30.A LED29.A LED28.A LED27.A LED26.A LED25.A LED24.A LED23.A LED22.A LED21.A LED20.A LED19.A
  Bottom 0.406: U104.10 20.97,31.76 21.6,31.13 47.32,31.13 | 47.32,31.13 64.47,31.13 | 64.47,31.13 83.52,31.13 84.15,31.76 U101.10 | 64.47,31.13 U102.10 | U103.10 47.32,31.13
A0  (1 unrouted)
A1  (1 unrouted)
A2  (1 unrouted)
A3  (1 unrouted)
A4  (1 unrouted)
A5  (1 unrouted)
A6  (1 unrouted)
A7  (1 unrouted)
A8  (1 unrouted)
A9  (1 unrouted)
A10  (1 unrouted)
A11  (1 unrouted)
A12  (1 unrouted)
A13  (1 unrouted)
A14  (1 unrouted)
A15  (1 unrouted)
AUX1_DOWN  (1 unrouted)
AUX1_UP  (1 unrouted)
AUX2_DOWN  (1 unrouted)
AUX2_UP  (1 unrouted)
CLR  (1 unrouted)
D0  (1 unrouted)
D1  (1 unrouted)
D2  (1 unrouted)
D3  (1 unrouted)
D4  (1 unrouted)
D5  (1 unrouted)
D6  (1 unrouted)
D7  (1 unrouted)
DEPOSIT  (1 unrouted)
DEPOSIT_NEXT  (1 unrouted)
DUE_RESET
  Bottom 0.406: C100.+ 44.01,7.63 73.99,7.63 74.63,7 PCB1.RESET
EXAMINE  (1 unrouted)
EXAMINE_NEXT  (1 unrouted)
GND  (18 unrouted)
  Top 0.406: S7.P2 31.64,14.49 32.08,14.94 41.92,14.94 | 41.92,14.94 52.08,14.94 | 52.08,14.94 62.24,14.94 | 62.24,14.94 72.4,14.94 | 72.4,14.94 82.56,14.94 | 82.56,14.94 92.72,14.94 | 92.72,14.94 102.25,14.94 102.76,14.43 S14.P2 | S13.P2 92.72,14.28 92.72,14.94 | S12.P2 82.56,14.28 82.56,14.94 | S11.P2 72.4,14.28 72.4,14.94 | S10.P2 62.24,14.28 62.24,14.94 | S9.P2 52.08,14.28 52.08,14.94 | S8.P2 41.92,14.28 41.92,14.94
  Bottom 0.406: U104.9 20.97,27.95 21.6,28.59 47.32,28.59 | 47.32,28.59 64.47,28.59 | 64.47,28.59 83.52,28.59 84.15,27.95 U101.9 | U102.9 64.47,28.59 | U103.9 47.32,28.59 | R101.2 R102.2 R103.2 | R104.2 R105.2 R106.2 | R109.2 R108.2 R107.2 | R112.2 R111.2 R110.2 | R115.2 R114.2 R113.2 | 34.89,6.36 R100.1 33.67,7.69 33.67,11.5 R116.2
HLDA  (1 unrouted)
HLTA  (1 unrouted)
INP  (1 unrouted)
INT  (1 unrouted)
INTE  (1 unrouted)
M1  (1 unrouted)
MEMR  (1 unrouted)
MISO  (1 unrouted)
MOSI  (1 unrouted)
N$1  (1 unrouted)
N$2  (1 unrouted)
N$3  (1 unrouted)
N$4  (1 unrouted)
N$5  (1 unrouted)
N$6  (1 unrouted)
N$7  (1 unrouted)
N$8  (1 unrouted)
N$9  (1 unrouted)
N$10  (1 unrouted)
N$11  (1 unrouted)
N$12  (1 unrouted)
N$13
  Bottom 0.406: R100.2 35.84,7.32 C100.-
N$14  (1 unrouted)
N$15  (1 unrouted)
N$16  (1 unrouted)
N$17  (1 unrouted)
N$18  (1 unrouted)
N$19  (1 unrouted)
N$20  (1 unrouted)
N$21  (1 unrouted)
N$22  (1 unrouted)
N$23  (1 unrouted)
N$24  (1 unrouted)
N$25  (1 unrouted)
N$26  (1 unrouted)
N$27  (1 unrouted)
N$28  (1 unrouted)
N$29  (1 unrouted)
N$30  (1 unrouted)
N$31  (1 unrouted)
N$32  (1 unrouted)
N$33  (1 unrouted)
N$34  (1 unrouted)
N$35  (1 unrouted)
N$36  (1 unrouted)
N$37  (1 unrouted)
N$38  (1 unrouted)
N$39  (1 unrouted)
N$40  (1 unrouted)
N$41  (1 unrouted)
N$42  (1 unrouted)
N$43  (1 unrouted)
N$44  (1 unrouted)
N$45  (1 unrouted)
N$46  (1 unrouted)
N$47  (1 unrouted)
N$48  (1 unrouted)
N$49  (1 unrouted)
N$50  (1 unrouted)
N$51  (1 unrouted)
N$52  (1 unrouted)
N$53  (1 unrouted)
N$54  (1 unrouted)
N$55  (1 unrouted)
N$56  (1 unrouted)
N$57  (1 unrouted)
N$58  (1 unrouted)
N$59  (1 unrouted)
N$60  (1 unrouted)
N$61  (1 unrouted)
N$62  (1 unrouted)
N$63  (1 unrouted)
N$64  (1 unrouted)
N$65  (1 unrouted)
N$66  (1 unrouted)
N$67  (1 unrouted)
N$68  (1 unrouted)
N$69  (1 unrouted)
N$70  (1 unrouted)
N$71  (1 unrouted)
N$72  (1 unrouted)
N$73  (1 unrouted)
N$74  (1 unrouted)
N$75  (1 unrouted)
N$76  (1 unrouted)
N$77  (1 unrouted)
N$78  (1 unrouted)
N$79  (1 unrouted)
N$80  (1 unrouted)
N$81  (1 unrouted)
N$82  (1 unrouted)
N$83  (1 unrouted)
N$84  (1 unrouted)
N$85  (1 unrouted)
N$86  (1 unrouted)
N$87  (1 unrouted)
N$88  (1 unrouted)
N$89  (1 unrouted)
N$90  (1 unrouted)
N$91  (1 unrouted)
N$92  (1 unrouted)
N$93  (1 unrouted)
N$94  (1 unrouted)
N$95  (1 unrouted)
N$96  (1 unrouted)
N$97  (1 unrouted)
N$98  (1 unrouted)
N$106  (1 unrouted)
N$107  (1 unrouted)
N$108  (1 unrouted)
N$109  (1 unrouted)
N$110  (1 unrouted)
N$113  (1 unrouted)
N$114  (1 unrouted)
N$115  (1 unrouted)
N$116  (1 unrouted)
N$117  (1 unrouted)
N$118  (1 unrouted)
N$119  (1 unrouted)
N$120  (1 unrouted)
OUT  (1 unrouted)
PROT  (1 unrouted)
PROTECT  (1 unrouted)
RESET  (1 unrouted)
RUN  (1 unrouted)
SCK  (1 unrouted)
SERIAL_RX  (1 unrouted)
SERIAL_TX  (1 unrouted)
SLOW  (1 unrouted)
STACK  (1 unrouted)
STEP  (1 unrouted)
STOP  (1 unrouted)
SW0  (2 unrouted)
SW1  (2 unrouted)
SW2  (2 unrouted)
SW3  (2 unrouted)
SW4  (2 unrouted)
SW5  (2 unrouted)
SW6  (2 unrouted)
SW7  (2 unrouted)
SW8  (2 unrouted)
SW9  (2 unrouted)
SW10  (2 unrouted)
SW11  (2 unrouted)
SW12  (2 unrouted)
SW13  (2 unrouted)
SW14  (2 unrouted)
SW15  (2 unrouted)
UNPROTECT  (1 unrouted)
VCC  (6 unrouted)
  Top 0.406: S6.4 S6.5 S6.6 | S5.4 S5.5 S5.6 | S4.4 S4.5 S4.6 | S3.4 S3.5 S3.6 | S2.6 S2.5 S2.4
VIN  (1 unrouted)
WAIT  (1 unrouted)
WO  (1 unrouted)

### Text on the board
tPlace: INTE | PROT | MEMR | INP | MI | OUT | HLTA | STACK | WO | INT | D7 | D6 | D5 | D4 | D3 | D2 | D1 | D0 | STATUS | WAIT | HLDA | A15 | A14 | A13 | A12 | A11 | A10 | A9 | A8 | A7 | A6 | A5 | A4 | A3 | A2 | A1 | A0 | 15 | 14 | 13 | 12 | 11 | 10 | 9 | 8 | 7 | 6 | 5 | 4 | 3 | 2 | 1 | 0 | SENSE SW. | DATA | ADDRESS | OFF | STOP | SINGLE STEP | EXAMINE | DEPOSIT | RESET | PROTECT | AUX | AUX | ON | RUN | EXAMINE NXT | DEPOSIT NXT | CLR | UNPROTECT